# Altium schematic sheet MCU.SchDoc
size A4
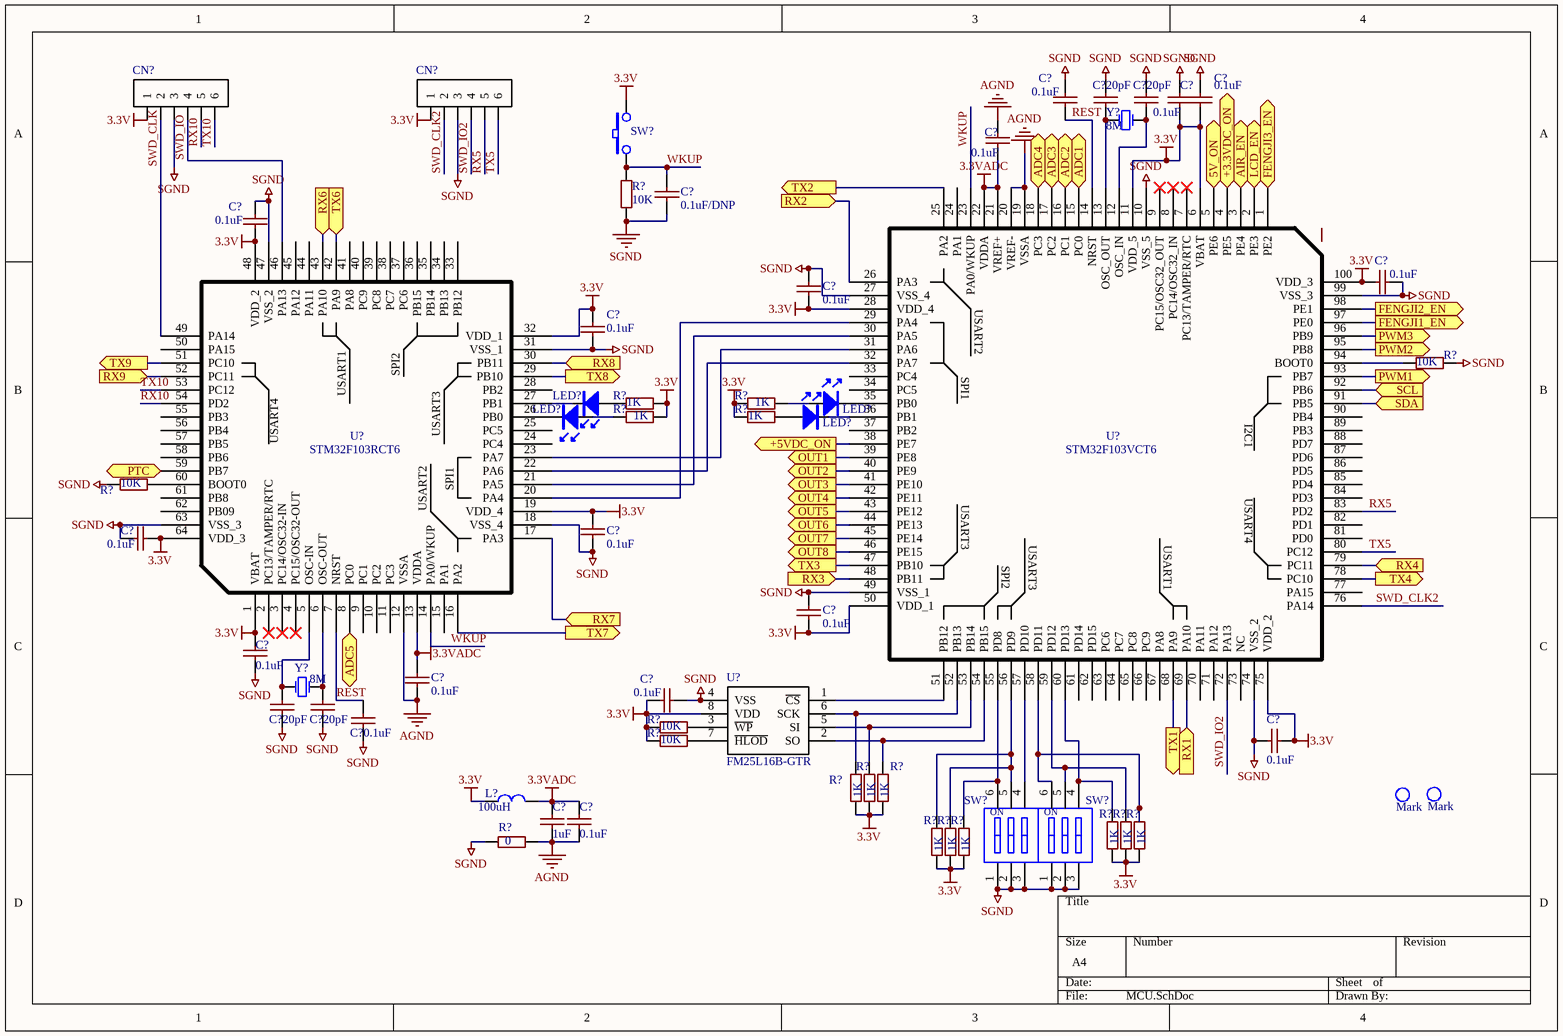
[diagram p0: MCU.SchDoc]

## Parts
(Parts that share a designator on the sheet are numbered #1, #2 ... from top to bottom, then left to right.)
C?#1  0.1uF  [0603_C]
C?#2  20pF  [0603_C]
C?#3  20pF  [0603_C]
C?#4  0.1uF  [0603_C]
C?#5  0.1uF  [0603_C]
C?#6  0.1uF  [0603_C]
C?#7  0.1uF/DNP  [0603_C]
C?#8  0.1uF  [0603_C]
C?#9  0.1uF  [0603_C]
C?#10  0.1uF  [0603_C]
C?#11  0.1uF  [0603_C]
C?#12  0.1uF  [0603_C]
C?#13  0.1uF  [0603_C]
C?#14  0.1uF  [0603_C]
C?#15  0.1uF  [0603_C]
C?#16  0.1uF  [0603_C]
C?#17  0.1uF  [0603_C]
C?#18  20pF  [0603_C]
C?#19  20pF  [0603_C]
C?#20  0.1uF  [0603_C]
C?#21  0.1uF  [0603_C]
C?#22  1uF  [0603_C]
C?#23  0.1uF  [0603_C]
CN?#1  CON6  [CON6]  (value not drawn)
CN?#2  CON6  [CON6]  (value not drawn)
L?  100uH  [0603_L]
LED?#1  Led  [0603_LED]  (value not drawn)
LED?#2  Led  [0603_LED]  (value not drawn)
LED?#3  Led  [0603_LED]  (value not drawn)
LED?#4  Led  [0603_LED]  (value not drawn)
M?#1  Mark  [Mark]
M?#2  Mark  [Mark]
R?#1  10K  [0603_R]
R?#2  10K  [0603_R]
R?#3  1K  [0603_R]
R?#4  1K  [0603_R]
R?#5  1K  [0603_R]
R?#6  1K  [0603_R]
R?#7  10K  [0603_R]
R?#8  10K  [0603_R]
R?#9  10K  [0603_R]
R?#10  1K  [0603_R]
R?#11  1K  [0603_R]
R?#12  1K  [0603_R]
R?#13  1K  [0603_R]
R?#14  1K  [0603_R]
R?#15  1K  [0603_R]
R?#16  0  [0603_R]
R?#17  1K  [0603_R]
R?#18  1K  [0603_R]
R?#19  1K  [0603_R]
SW?#1  Button  [SW2_12x12]  (value not drawn)
SW?#2  DSHP02TSGET  [DSHP02TSGET]  (value not drawn)
SW?#3  DSHP02TSGET  [DSHP02TSGET]  (value not drawn)
U?#1  STM32F103VCT6  [LQFP100]
U?#2  STM32F103RCT6  [LQFP64]
U?#3  FM25L16B-GTR  [SO8]
Y?#1  8M  [SMD_5032_4p]
Y?#2  8M  [SMD_5032_4p]

## Ports
5V_ON (out), +3.3VDC_ON (out), +5VDC_ON (out), ADC1 (in), ADC2 (in), ADC3 (in), ADC4 (in), ADC5 (in), AIR_EN (out), FENGJI1_EN (out), FENGJI2_EN (out), FENGJI3_EN (out), LCD_EN (out), OUT1 (out), OUT2 (out), OUT3 (out), OUT4 (out), OUT5 (out), OUT6 (out), OUT7 (out), OUT8 (out), PTC (out), PWM1 (out), PWM2 (out), PWM3 (out), RX1 (in), RX2 (in), RX3 (in), RX4 (in), RX6 (in), RX7 (in), RX8 (in), RX9 (in), SCL (in), SDA (in), TX1 (out), TX2 (out), TX3 (out), TX4 (out), TX6 (in), TX7 (out), TX8 (out), TX9 (out)

## Nets
3.3V: C?#4.2 C?#5.2 C?#8.2 C?#9.2 C?#10.2 C?#11.1 C?#12.1 C?#13.2 C?#14.2 C?#15.2 C?#17.1 C?#21.1 CN?#1.1 CN?#2.1 L?.1 R?#3.2 R?#4.2 R?#5.2 R?#6.2 R?#8.2 R?#9.2 R?#10.1 R?#11.1 R?#12.1 R?#13.1 R?#14.1 R?#15.1 R?#17.1 R?#18.1 R?#19.1 SW?#1.2 U?#1.6(VBAT) U?#1.11(VDD_5) U?#1.28(VDD_4) U?#1.50(VDD_1) U?#1.75(VDD_2) U?#1.100(VDD_3) U?#2.1(VBAT) U?#2.19(VDD_4) U?#2.32(VDD_1) U?#2.48(VDD_2) U?#2.64(VDD_3) U?#3.8(VDD)
3.3VADC: C?#6.1 C?#16.2 C?#22.2 C?#23.2 L?.2 U?#1.21(VREF+) U?#1.22(VDDA) U?#2.13(VDDA)
AGND: C?#6.2 C?#16.1 C?#22.1 C?#23.1 R?#16.1 U?#1.19(VSSA) U?#1.20(VREF-) U?#2.12(VSSA)
SGND: C?#1.1 C?#2.1 C?#3.1 C?#4.1 C?#5.1 C?#7.1 C?#8.1 C?#9.1 C?#10.1 C?#11.2 C?#12.2 C?#13.1 C?#14.1 C?#15.1 C?#17.2 C?#18.2 C?#19.2 C?#20.1 C?#21.2 CN?#1.3 CN?#2.3 R?#1.2 R?#2.1 R?#7.2 R?#16.2 SW?#2.1(A1) SW?#2.2(A2) SW?#2.3(B2) SW?#3.1(A1) SW?#3.2(A2) SW?#3.3(B2) U?#1.10(VSS_5) U?#1.27(VSS_4) U?#1.49(VSS_1) U?#1.74(VSS_2) U?#1.99(VSS_3) U?#2.18(VSS_4) U?#2.31(VSS_1) U?#2.47(VSS_2) U?#2.63(VSS_3) U?#3.4(VSS)
5V_ON: U?#1.5(PE6) ; port 5V_ON
+3.3VDC_ON: U?#1.4(PE5) ; port +3.3VDC_ON
+5VDC_ON: U?#1.38(PE7) ; port +5VDC_ON
ADC1: U?#1.15(PC0) ; port ADC1
ADC2: U?#1.16(PC1) ; port ADC2
ADC3: U?#1.17(PC2) ; port ADC3
ADC4: U?#1.18(PC3) ; port ADC4
ADC5: U?#2.8(PC0) ; port ADC5
AIR_EN: U?#1.3(PE4) ; port AIR_EN
FENGJI1_EN: U?#1.97(PE0) ; port FENGJI1_EN
FENGJI2_EN: U?#1.98(PE1) ; port FENGJI2_EN
FENGJI3_EN: U?#1.1(PE2) ; port FENGJI3_EN
LCD_EN: U?#1.2(PE3) ; port LCD_EN
OUT1: U?#1.39(PE8) ; port OUT1
OUT2: U?#1.40(PE9) ; port OUT2
OUT3: U?#1.41(PE10) ; port OUT3
OUT4: U?#1.42(PE11) ; port OUT4
OUT5: U?#1.43(PE12) ; port OUT5
OUT6: U?#1.44(PE13) ; port OUT6
OUT7: U?#1.45(PE14) ; port OUT7
OUT8: U?#1.46(PE15) ; port OUT8
PTC: U?#2.59(PB7) ; port PTC
PWM1: U?#1.93(PB7) ; port PWM1
PWM2: U?#1.95(PB8) ; port PWM2
PWM3: U?#1.96(PB9) ; port PWM3
REST: C?#1.2 C?#20.2 U?#1.14(NRST) U?#2.7(NRST)
RX1: U?#1.69(PA10) ; port RX1
RX2: U?#1.26(PA3) ; port RX2
RX3: U?#1.48(PB11) ; port RX3
RX4: U?#1.79(PC11) ; port RX4
RX5: CN?#2.5 U?#1.83(PD2)
RX6: U?#2.43(PA10) ; port RX6
RX7: U?#2.17(PA3) ; port RX7
RX8: U?#2.30(PB11) ; port RX8
RX9: U?#2.52(PC11) ; port RX9
RX10: CN?#1.5 U?#2.54(PD2)
SCL: U?#1.92(PB6) ; port SCL
SDA: U?#1.91(PB5) ; port SDA
SWD_CLK: CN?#1.2 U?#2.49(PA14)
SWD_CLK2: CN?#2.2 U?#1.76(PA14)
SWD_IO: CN?#1.4 U?#2.46(PA13)
SWD_IO2: CN?#2.4 U?#1.72(PA13)
TX1: U?#1.68(PA9) ; port TX1
TX2: U?#1.25(PA2) ; port TX2
TX3: U?#1.47(PB10) ; port TX3
TX4: U?#1.78(PC10) ; port TX4
TX5: CN?#2.6 U?#1.80(PC12)
TX6: U?#2.42(PA9) ; port TX6
TX7: U?#2.16(PA2) ; port TX7
TX8: U?#2.29(PB10) ; port TX8
TX9: U?#2.51(PC10) ; port TX9
TX10: CN?#1.6 U?#2.53(PC12)
WKUP: C?#7.2 R?#1.1 SW?#1.1 U?#1.23(PA0/WKUP) U?#2.14(PA0/WKUP)
NetC?#2_2: C?#2.2 U?#1.13(OSC_OUT) Y?#1.1(OSC1)
NetC?#3_2: C?#3.2 U?#1.12(OSC_IN) Y?#1.3(OSC2)
NetC?#18_1: C?#18.1 U?#2.5(OSC-IN) Y?#2.3(OSC2)
NetC?#19_1: C?#19.1 U?#2.6(OSC-OUT) Y?#2.1(OSC1)
NetLED?#1_A: LED?#1.A R?#4.1
NetLED?#1_K: LED?#1.K U?#1.35(PB0)
NetLED?#2_A: LED?#2.A R?#6.1
NetLED?#2_K: LED?#2.K U?#1.36(PB1)
NetLED?#3_A: LED?#3.A R?#3.1
NetLED?#3_K: LED?#3.K U?#2.27(PB1)
NetLED?#4_A: LED?#4.A R?#5.1
NetLED?#4_K: LED?#4.K U?#2.26(PB0)
NetR?#2_2: R?#2.2 U?#1.94(BOOT0)
NetR?#7_1: R?#7.1 U?#2.60(BOOT0)
NetR?#8_1: R?#8.1 U?#3.3(~{WP})
NetR?#9_1: R?#9.1 U?#3.7(~{HLOD})
NetR?#10_2: R?#10.2 U?#1.52(PB13) U?#3.6(SCK)
NetR?#11_2: R?#11.2 U?#1.53(PB14) U?#3.5(SI)
NetR?#12_2: R?#12.2 U?#1.54(PB15) U?#3.2(SO)
NetR?#13_2: R?#13.2 SW?#3.4(B1) U?#1.60(PD13)
NetR?#14_2: R?#14.2 SW?#3.5(B2) U?#1.59(PD12)
NetR?#15_2: R?#15.2 SW?#3.6(B3) U?#1.58(PD11)
NetR?#17_2: R?#17.2 R?#18.2 SW?#2.5(B2) U?#1.56(PD9)
NetR?#19_2: R?#19.2 SW?#2.6(B3) U?#1.55(PD8)
NetSW?#2_4: SW?#2.4(B1) U?#1.57(PD10)
NetU?#1_29: U?#1.29(PA4) U?#2.20(PA4)
NetU?#1_30: U?#1.30(PA5) U?#2.21(PA5)
NetU?#1_31: U?#1.31(PA6) U?#2.23(PA7)
NetU?#1_32: U?#1.32(PA7) U?#2.22(PA6)
NetU?#1_51: U?#1.51(PB12) U?#3.1(~{CS})

Not connected (* = marked no-connect by the designer): U?#1 7(PC13/TAMPER/RTC)* 8(PC14/OSC32_IN)* 9(PC15/OSC32_OUT)* 24(PA1) 33(PC4) 34(PC5) 37(PB2) 61(PD14) 62(PD15) 63(PC6) 64(PC7) 65(PC8) 66(PC9) 67(PA8) 70(PA11) 71(PA12) 73(NC) 77(PA15) 81(PD0) 82(PD1) 84(PD3) 85(PD4) 86(PD5) 87(PD6) 88(PD7) 89(PB3) 90(PB4); U?#2 2(PC13/TAMPER/RTC)* 3(PC14/OSC32-IN)* 4(PC15/OSC32-OUT)* 9(PC1) 10(PC2) 11(PC3) 15(PA1) 24(PC4) 25(PC5) 28(PB2) 33(PB12) 34(PB13) 35(PB14) 36(PB15) 37(PC6) 38(PC7) 39(PC8) 40(PC9) 41(PA8) 44(PA11) 45(PA12) 50(PA15) 55(PB3) 56(PB4) 57(PB5) 58(PB6) 61(PB8) 62(PB09); Y?#1 2 4; Y?#2 2 4

## Notes on the sheet
- (in symbol STM32F103RXXX) SPI2; USART1; USART3; USART4; SPI1; USART2
- (in symbol STM32F103VXXX) USART2; SPI1; I2C1; USART4; USART3; USART1; SPI2
- (in symbol 拨码开关) ON

## Library data of the parts
C?#1 C?#4-C?#17 C?#20 C?#21 C?#23 = CAP: 电容; 三星: CL10B104JB8NNNC; 风华: 0603B104J500NT
C?#2 C?#3 C?#18 C?#19 = CAP: 电容; 风华: 0603CG200J500NT; 三星: CL10C200JB8NNNC
C?#22 = CAP: 电容; 三星: CL10A105KP8NNNC; 风华: 0603X105K100NT
CN?#1 CN?#2 = CON6: 连接器
L? = Inductor: 电感
LED?#1-LED?#4 = Led: 发光二极管
M?#1 M?#2 = Mark: 标识点
R?#1-R?#9 = RES: 电阻; 厚生: 0603WAF1002T5E; 风华: RS-03K103FT
R?#10-R?#15 R?#17-R?#19 = RES: 电阻
R?#16 = RES: 电阻; 厚生: 0603WAF0000T5E; 风华: RS-03K000FT
SW?#1 = Button: 按键12*12*7.3
SW?#2 SW?#3 = 拨码开关
U?#1 = STM32F103VXXX: 单片机; 意法: STM32F103VCT6
U?#2 = STM32F103RXXX: STM32 64Pin
U?#3 = FM25: FRAM存储器
Y?#1 Y?#2 = 贴装晶振: Crystal Oscillator; 雅晶: 5032-SMD8.000M20PF